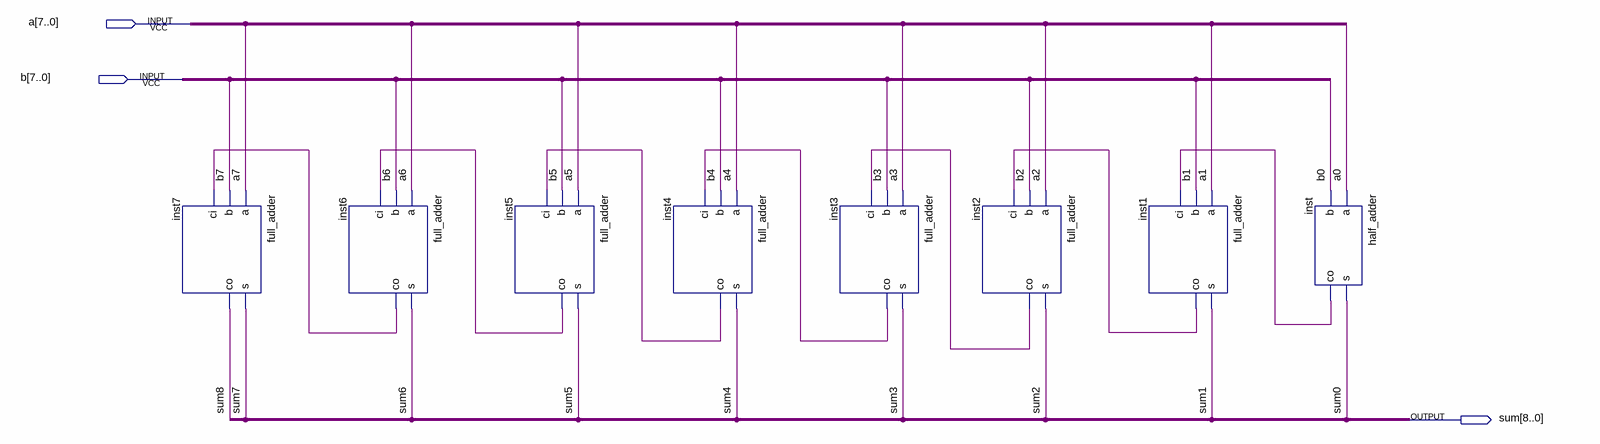
[diagram p0: schematic sheet]
// Quartus schematic eitbit_adder.bdf as structural Verilog: 8 symbols, 3 pins
module eitbit_adder (
  input  [7:0] a,
  input  [7:0] b,
  output [8:0] sum
);

  wire inst1_co, inst2_co, inst3_co, inst4_co, inst5_co, inst6_co, inst_co;

  full_adder inst7 (.a(a[7]), .b(b[7]), .ci(inst6_co), .s(sum[7]), .co(sum[8]));
  full_adder inst6 (.a(a[6]), .b(b[6]), .ci(inst5_co), .s(sum[6]), .co(inst6_co));
  full_adder inst5 (.a(a[5]), .b(b[5]), .ci(inst4_co), .s(sum[5]), .co(inst5_co));
  full_adder inst4 (.a(a[4]), .b(b[4]), .ci(inst3_co), .s(sum[4]), .co(inst4_co));
  full_adder inst3 (.a(a[3]), .b(b[3]), .ci(inst2_co), .s(sum[3]), .co(inst3_co));
  full_adder inst2 (.a(a[2]), .b(b[2]), .ci(inst1_co), .s(sum[2]), .co(inst2_co));
  full_adder inst1 (.a(a[1]), .b(b[1]), .ci(inst_co), .s(sum[1]), .co(inst1_co));
  half_adder inst (.a(a[0]), .b(b[0]), .s(sum[0]), .co(inst_co));
endmodule
